# EAGLE design probe (EAGLE 7.6.0)
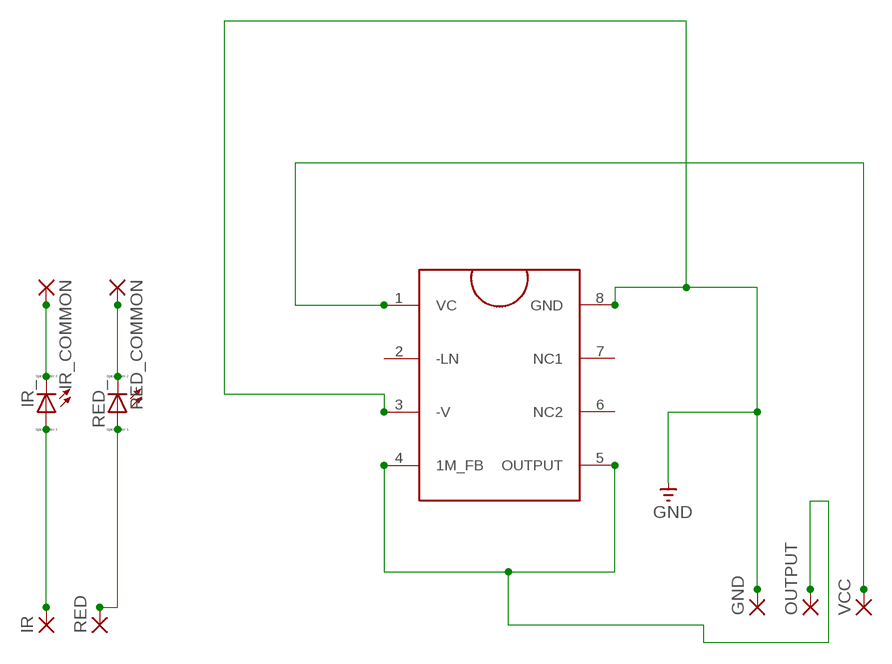
[diagram p0: schematic, sheet 1]

## Parts
GND  SMD2  [SMD1,27-2,54]
IR  SMD2  [SMD1,27-2,54]
IR_  LED_E  [LED_1206]
IR_COMMON  SMD2  [SMD1,27-2,54]
OUTPUT  SMD2  [SMD1,27-2,54]
RED  SMD2  [SMD1,27-2,54]
RED_  LED_E  [LED_1206]
RED_COMMON  SMD2  [SMD1,27-2,54]
U$1  OPT101  [SO8]
VCC  SMD2  [SMD1,27-2,54]

## Nets
GND: GND.1(P) U$1.3(-V) U$1.8(GND)
N$2: U$1.1(VC) VCC.1(P)
N$3: OUTPUT.1(P) U$1.4(1M_FB) U$1.5(OUTPUT)
N$4: IR.1(P) IR_.A
N$5: RED.1(P) RED_.A
N$6: RED_.C RED_COMMON.1(P)
N$7: IR_.C IR_COMMON.1(P)
Unconnected: U$1.2(-LN) U$1.6(NC2) U$1.7(NC1)

## Library data of the parts
GND IR IR_COMMON OUTPUT RED RED_COMMON VCC = wirepad:SMD2: SMD PAD
IR_ RED_ = eagle-ltspice:LED_E: LED Source: http://www.osram.convergy.de Source: www.luxeon.com Source: www.kingbright.com; SPICEMODEL: NONE; SPICEPREFIX: D; SPICETYPE: diode
U$1 = zetex:OPT101

## Board
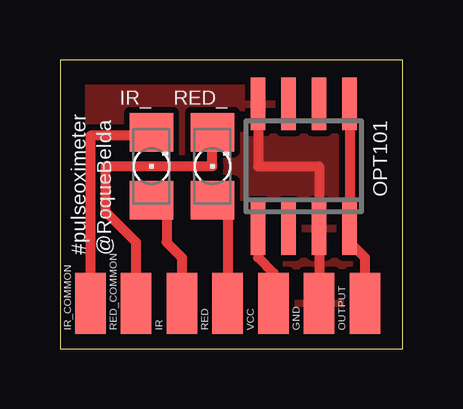
[diagram p1: board, top side]

Size 14.28 x 12.05 mm. Coordinates in mm from the lower left corner, seen from the top.
Outline: 0,0 14.28,0 14.28,12.05 0,12.05 0,0
Copper layers (1*16): Top 0.035mm / dielectric 1.5mm / Bottom 0.035mm
Design rules "default": minimum track width 10mil, minimum drill 24mil, track to track 8mil, track to pad 8mil, pad to pad 8mil, via to via 8mil, smd to smd 8mil, copper to edge 40mil, drill to drill 8mil, minimum pad ring 10mil, minimum via ring 8mil, stop-mask expansion 4mil, vias tented up to drill 0mil, thermal gap 10mil

### Footprints (pad centres in the part's own frame; a part is rotated, then mirrored left to right if it is on the bottom)
SMD1,27-2,54 = smd 1.27 x 2.54: 1 0,0
LED_1206 = smd 1.6 x 1.803: A -1.422,0; C 1.422,0
SO8 = smd 0.6 x 2.2: 1 -1.905,-2.6; 2 -0.635,-2.6; 3 0.635,-2.6; 4 1.905,-2.6; 5 1.905,2.6; 6 0.635,2.6; 7 -0.635,2.6; 8 -1.905,2.6

### Placement (x,y rotation side)
GND  10.79,1.9 0 top
IR  5.08,1.9 0 top
IR_  3.81,7.62 90 top
IR_COMMON  1.27,1.9 0 top
OUTPUT  12.7,1.9 0 top
RED  6.99,1.9 0 top
RED_  6.35,7.62 90 top
RED_COMMON  3.17,1.9 0 top
U$1  10.16,7.62 0 top
VCC  8.89,1.9 0 top

### Tracks (layer width: path | path; a pad name or v marks a point on that pad's centre or on a via)
GND
  Top 0.406: U$1.8 8.26,7.62 10.79,7.62 U$1.3 GND.1
  pour Top (isolate 0.254): 14.61,12.07 0,12.07 0,-2.54 14.61,-2.54
N$2
  Top 0.406: U$1.1 8.26,3.81 8.89,3.18 VCC.1
N$3
  Top 0.406: U$1.5 U$1.4 12.06,4.45 12.7,3.81 OUTPUT.1
N$4
  Top 0.406: IR_.A 4.45,5.56 4.45,4.45 5.08,3.81 IR.1
N$5
  Top 0.406: RED_.A 6.99,5.56 RED.1
N$6
  Top 0.406: RED_COMMON.1 3.17,4.45 1.91,5.71 1.91,7.62 6.35,7.62 RED_.C
N$7
  Top 0.406: IR_.C 3.66,8.89 1.27,8.89 IR_COMMON.1

### Text on the board
tPlace: #pulseoximeter | @RoqueBelda